# Altium schematic sheet AnalogSigCond.SchDoc: Analog Signal Front-End
size Letter; Engineer: Nathan Petersen; DocumentNumber: 9; Revision: v1.2; SheetNumber: 9; SheetTotal: 23
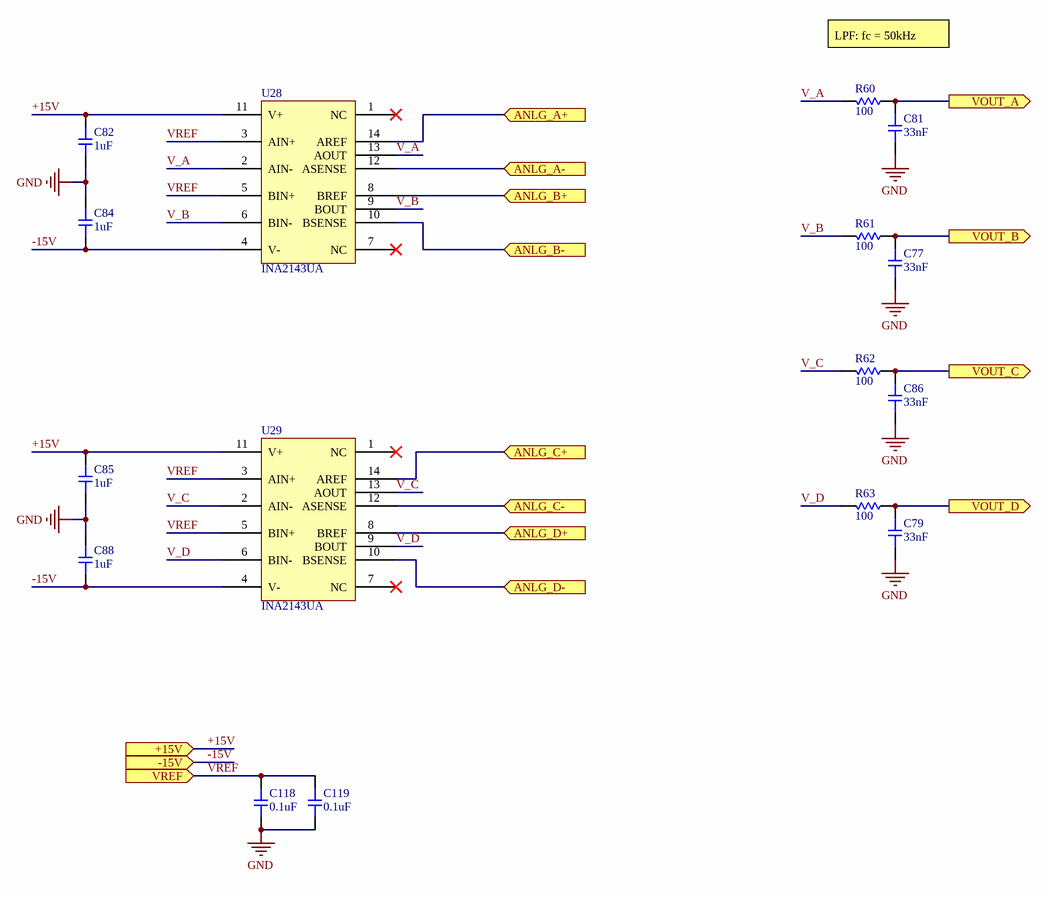
[diagram p0: AnalogSigCond.SchDoc]

## Parts
C77  value 33nF  [0603-CAP]  (hidden comment: Capacitor)
C79  value 33nF  [0603-CAP]  (hidden comment: Capacitor)
C81  value 33nF  [0603-CAP]  (hidden comment: Capacitor)
C82  value 1uF  [0603-CAP]  (hidden comment: Capacitor)
C84  value 1uF  [0603-CAP]  (hidden comment: Capacitor)
C85  value 1uF  [0603-CAP]  (hidden comment: Capacitor)
C86  value 33nF  [0603-CAP]  (hidden comment: Capacitor)
C88  value 1uF  [0603-CAP]  (hidden comment: Capacitor)
C118  value 0.1uF  [0603-CAP]  (hidden comment: Capacitor)
C119  value 0.1uF  [0603-CAP]  (hidden comment: Capacitor)
R60  value 100  [0603-RES]  (hidden comment: Resistor)
R61  value 100  [0603-RES]  (hidden comment: Resistor)
R62  value 100  [0603-RES]  (hidden comment: Resistor)
R63  value 100  [0603-RES]  (hidden comment: Resistor)
U28  INA2143UA  [SOIC127P600X175-14N]
U29  INA2143UA  [SOIC127P600X175-14N]

## Ports
+15V (in), -15V (in), ANLG_A+ (in), ANLG_A- (in), ANLG_B+ (in), ANLG_B- (in), ANLG_C+ (in), ANLG_C- (in), ANLG_D+ (in), ANLG_D- (in), VOUT_A (out), VOUT_B (out), VOUT_C (out), VOUT_D (out), VREF (in)

## Nets
GND: C77.2 C79.2 C81.2 C82.1 C84.2 C85.1 C86.2 C88.2 C118.2 C119.2
+15V: C82.2 C85.2 U28.11(V+) U29.11(V+) ; port +15V
-15V: C84.1 C88.1 U28.4(V-) U29.4(V-) ; port -15V
ANLG_A+: U28.14(AREF) ; port ANLG_A+
ANLG_A-: U28.12(ASENSE) ; port ANLG_A-
ANLG_B+: U28.8(BREF) ; port ANLG_B+
ANLG_B-: U28.10(BSENSE) ; port ANLG_B-
ANLG_C+: U29.14(AREF) ; port ANLG_C+
ANLG_C-: U29.12(ASENSE) ; port ANLG_C-
ANLG_D+: U29.8(BREF) ; port ANLG_D+
ANLG_D-: U29.10(BSENSE) ; port ANLG_D-
V_A: R60.2 U28.2(AIN-) U28.13(AOUT)
V_B: R61.2 U28.6(BIN-) U28.9(BOUT)
V_C: R62.2 U29.2(AIN-) U29.13(AOUT)
V_D: R63.2 U29.6(BIN-) U29.9(BOUT)
VOUT_A: C81.1 R60.1 ; port VOUT_A
VOUT_B: C77.1 R61.1 ; port VOUT_B
VOUT_C: C86.1 R62.1 ; port VOUT_C
VOUT_D: C79.1 R63.1 ; port VOUT_D
VREF: C118.1 C119.1 U28.3(AIN+) U28.5(BIN+) U29.3(AIN+) U29.5(BIN+) ; port VREF

Not connected (* = marked no-connect by the designer): U28 1(NC)* 7(NC)*; U29 1(NC)* 7(NC)*

## Notes on the sheet
- LPF: fc = 50kHz
- Title:
- File:
- Sheet:
- of
- Revision:
- Time:
- Date:
- Engineer:

## Library data of the parts
U28 U29 = INA2143UA: IC OPAMP DIFF 150KHZ 14SOIC; Supplier 1: Digi-Key; Supplier Part Number 1: INA2143UA-ND
C77 C79 C81 C82 C84-C86 C88 C118 C119 = Capacitor: Supplier 1: Digi-Key
  C77 C79 C81 C86: Supplier Part Number 1: 1276-2041-1-ND
  C82 C84 C85 C88: Supplier Part Number 1: 1276-6524-6-ND
  C118 C119: Supplier Part Number 1: 1276-1012-6-ND
R60-R63 = Resistor: Supplier 1: Digi-Key; Supplier Part Number 1: YAG3561DKR-ND